# EAGLE design 00A-80 (EAGLE 6.3)
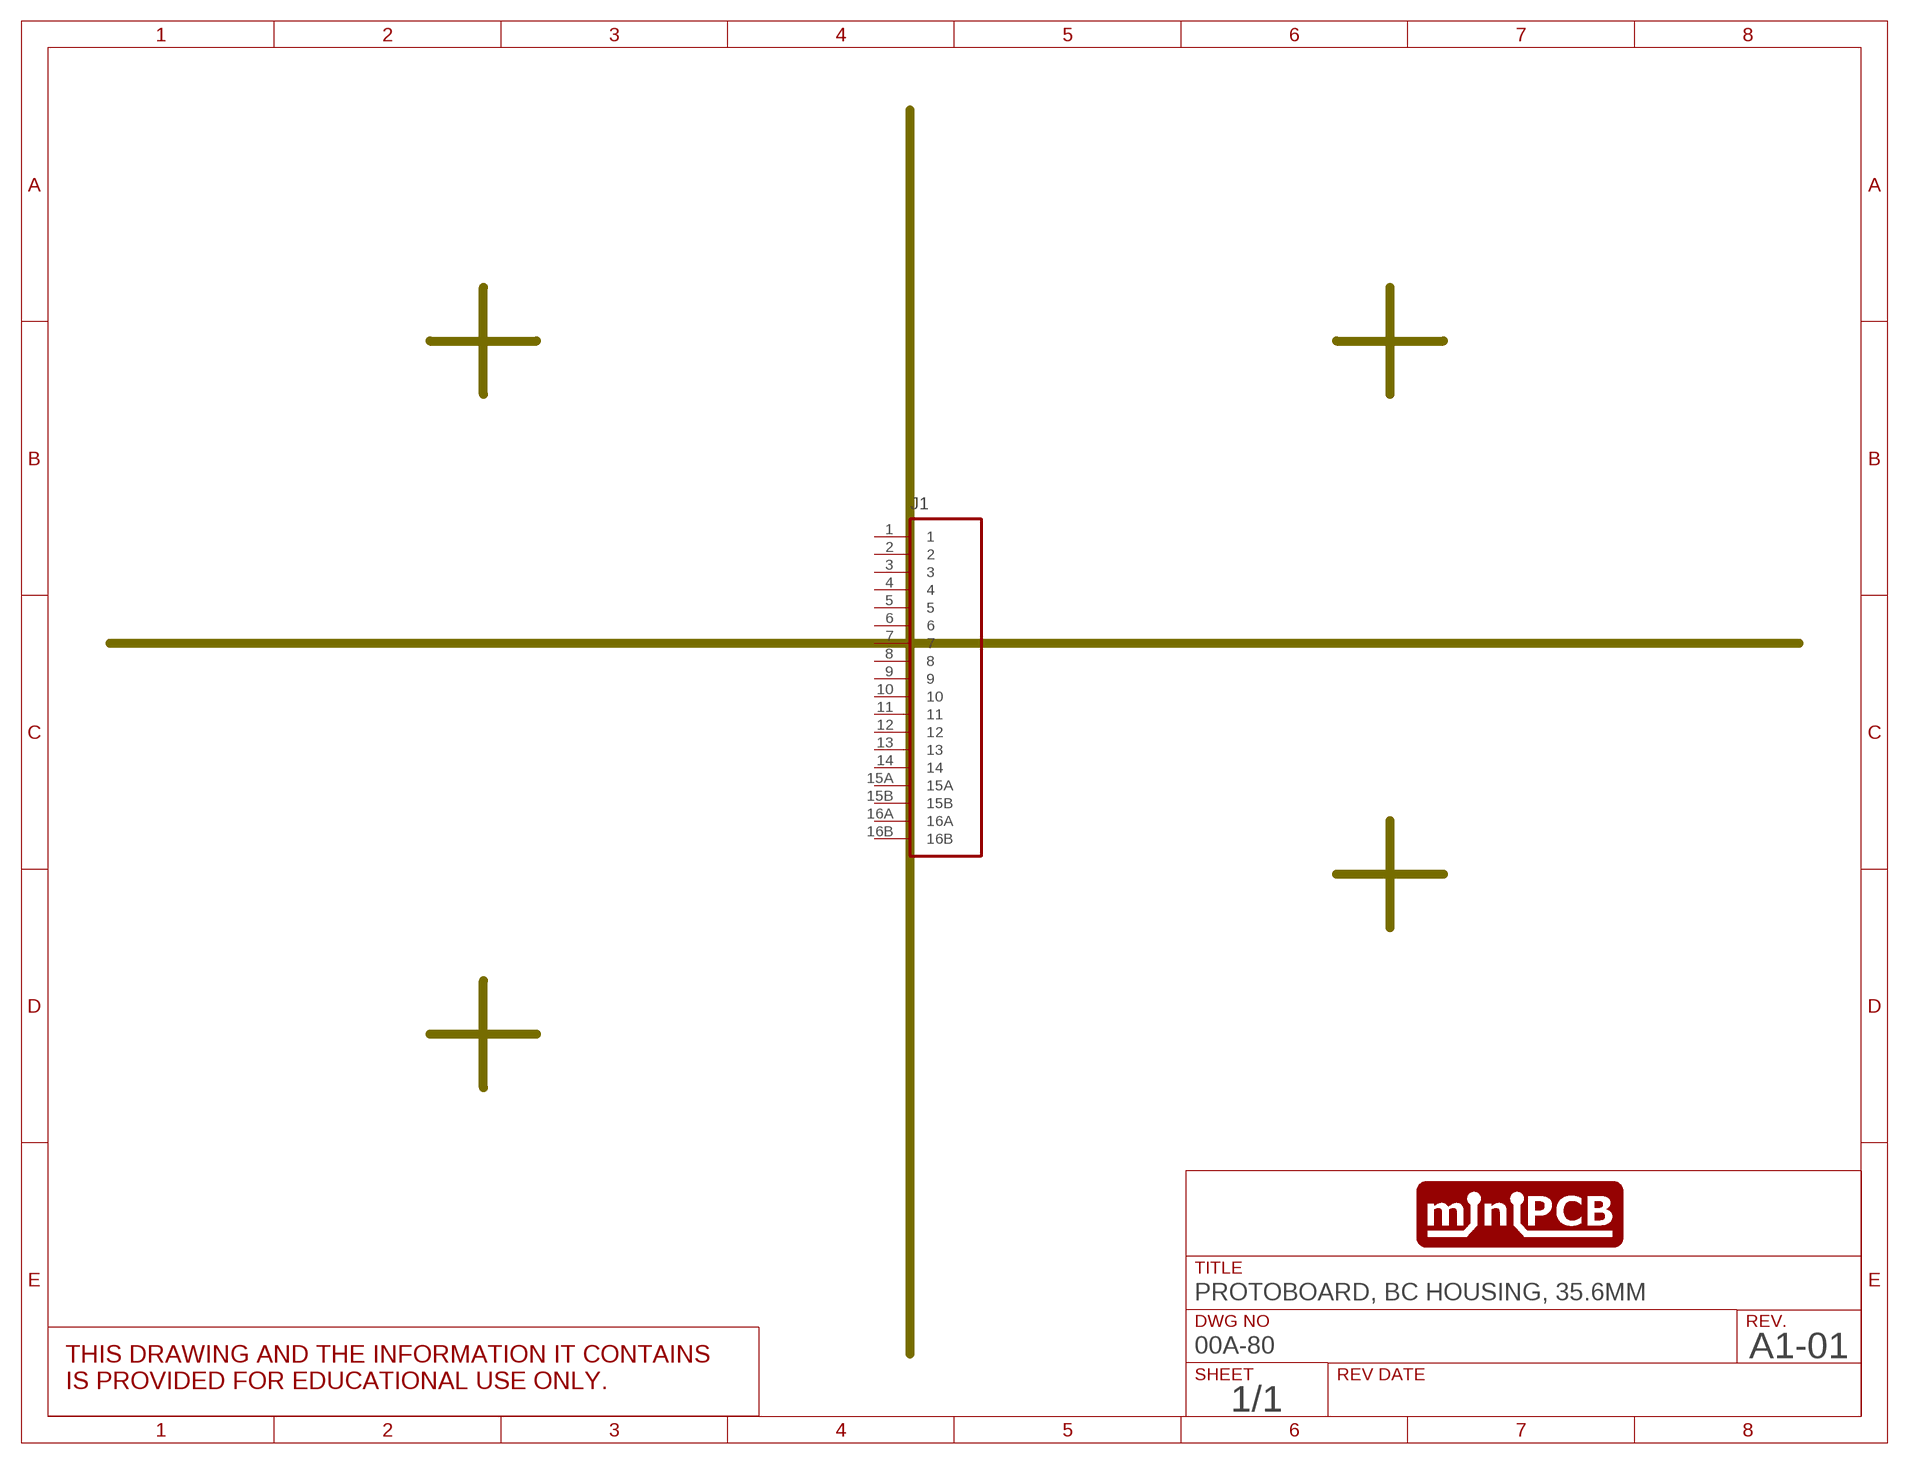
[diagram p0: schematic, sheet 1]
SHEET1 (SCHEMATIC): DWG_NO: 00A-80; REV: A1-01; TITLE: PROTOBOARD, BC HOUSING, 35.6MM

## Parts
J1  BC_HOUSING_35.6MM  [BC_HOUSING_35MM]
Unconnected: J1.1 J1.2 J1.3 J1.4 J1.5 J1.6 J1.7 J1.8 J1.9 J1.10 J1.11 J1.12 J1.13 J1.14 J1.15A J1.15B J1.16A J1.16B

## Library data of the parts
J1 = miniPCB_BOARDS:BC_HOUSING

## Board
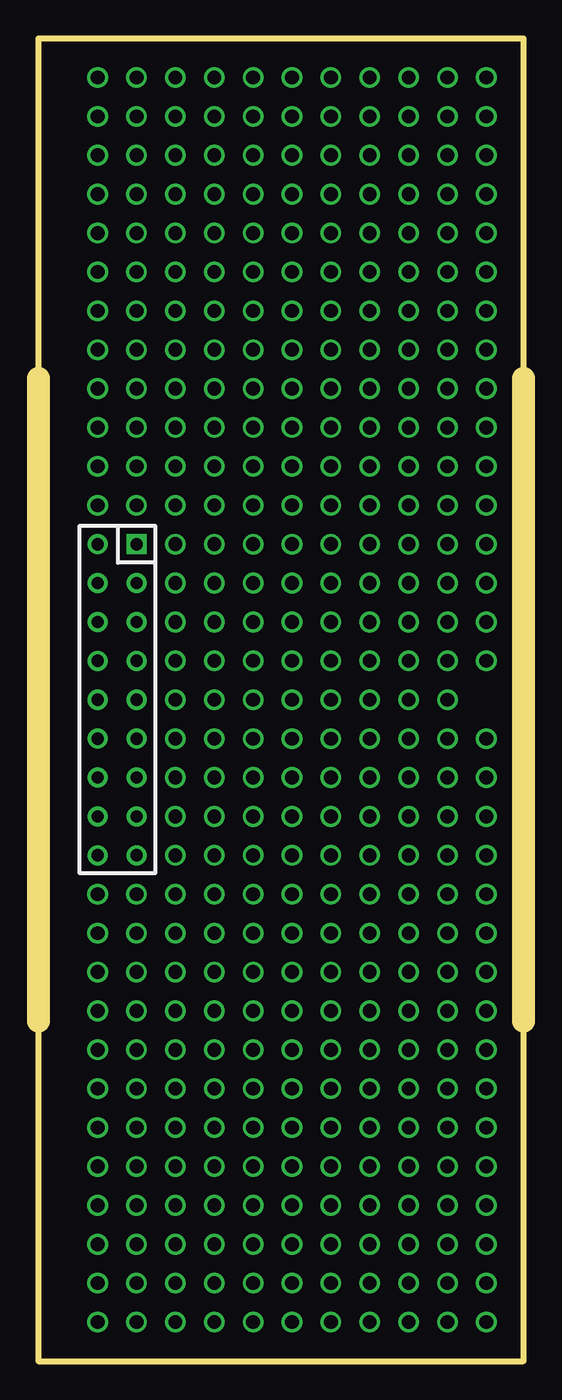
[diagram p1: board, top side]

Size 31.7 x 86.4 mm. Coordinates in mm from the lower left corner, seen from the top.
Copper layers (1*16): Top 0.035mm / dielectric 1.5mm / Bottom 0.035mm
Design rules "default": minimum track width 10mil, minimum drill 0.6mm, track to track 8mil, track to pad 8mil, pad to pad 8mil, via to via 8mil, smd to smd 8mil, copper to edge 40mil, drill to drill 8mil, minimum pad ring 10mil, minimum via ring 8mil, stop-mask expansion 4mil, vias tented up to drill 0mil, thermal gap 10mil

### Footprints (pad centres in the part's own frame; a part is rotated, then mirrored left to right if it is on the bottom)
BC_HOUSING_35MM = drill 0.8 square: 1 6.42,10.16 | drill 0.8: 2 3.88,10.16; 3 6.42,7.62; 4 3.88,7.62; 5 6.42,5.08; 6 3.88,5.08; 7 6.42,2.54; 8 3.88,2.54; 9 6.42,0; 10 3.88,0; 11 6.42,-2.54; 12 3.88,-2.54; 13 6.42,-5.08; 14 3.88,-5.08; 15A 6.42,-7.62; 15B 3.88,-7.62; 16A 6.42,-10.16; 16B 3.88,-10.16

### Placement (x,y rotation side)
J1  0,43.2 0 top

### Tracks (layer width: path | path; a pad name or v marks a point on that pad's centre or on a via)
N$1  (via drill 0.9)
  other vias: 3.88,60.98
N$2  (via drill 0.9)
  other vias: 3.88,58.44
N$3  (via drill 0.9)
  other vias: 6.42,58.44
N$4  (via drill 0.9)
  other vias: 6.42,60.98
N$5  (via drill 0.9)
  other vias: 8.96,60.98
N$6  (via drill 0.9)
  other vias: 8.96,58.44
N$7  (via drill 0.9)
  other vias: 3.88,55.9
N$8  (via drill 0.9)
  other vias: 6.42,55.9
N$9  (via drill 0.9)
  other vias: 8.96,55.9
N$10  (via drill 0.9)
  other vias: 8.96,53.36
N$11  (via drill 0.9)
  other vias: 8.96,50.82
N$12  (via drill 0.9)
  other vias: 8.96,48.28
N$13  (via drill 0.9)
  other vias: 8.96,45.74
N$14  (via drill 0.9)
  other vias: 8.96,43.2
N$15  (via drill 0.9)
  other vias: 8.96,40.66
N$16  (via drill 0.9)
  other vias: 8.96,38.12
N$17  (via drill 0.9)
  other vias: 8.96,35.58
N$18  (via drill 0.9)
  other vias: 8.96,33.04
N$19  (via drill 0.9)
  other vias: 8.96,30.5
N$20  (via drill 0.9)
  other vias: 6.42,30.5
N$21  (via drill 0.9)
  other vias: 3.88,30.5
N$22  (via drill 0.9)
  other vias: 3.88,27.96
N$23  (via drill 0.9)
  other vias: 6.42,27.96
N$24  (via drill 0.9)
  other vias: 8.96,27.96
N$25  (via drill 0.9)
  other vias: 3.88,25.42
N$26  (via drill 0.9)
  other vias: 6.42,25.42
N$27  (via drill 0.9)
  other vias: 8.96,25.42
N$28  (via drill 0.9)
  other vias: 8.96,22.88
N$29  (via drill 0.9)
  other vias: 6.42,22.88
N$30  (via drill 0.9)
  other vias: 3.88,22.88
N$31  (via drill 0.9)
  other vias: 11.5,22.88
N$32  (via drill 0.9)
  other vias: 11.5,25.42
N$33  (via drill 0.9)
  other vias: 11.5,27.96
N$34  (via drill 0.9)
  other vias: 11.5,30.5
N$35  (via drill 0.9)
  other vias: 11.5,33.04
N$36  (via drill 0.9)
  other vias: 11.5,35.58
N$37  (via drill 0.9)
  other vias: 11.5,38.12
N$38  (via drill 0.9)
  other vias: 11.5,40.66
N$39  (via drill 0.9)
  other vias: 11.5,43.2
N$40  (via drill 0.9)
  other vias: 11.5,45.74
N$41  (via drill 0.9)
  other vias: 11.5,48.28
N$42  (via drill 0.9)
  other vias: 11.5,50.82
N$43  (via drill 0.9)
  other vias: 11.5,53.36
N$44  (via drill 0.9)
  other vias: 11.5,55.9
N$45  (via drill 0.9)
  other vias: 11.5,58.44
N$46  (via drill 0.9)
  other vias: 11.5,60.98
N$47  (via drill 0.9)
  other vias: 11.5,63.52
N$48  (via drill 0.9)
  other vias: 8.96,63.52
N$49  (via drill 0.9)
  other vias: 6.42,63.52
N$50  (via drill 0.9)
  other vias: 3.88,63.52
N$51  (via drill 0.9)
  other vias: 14.04,60.98
N$52  (via drill 0.9)
  other vias: 14.04,58.44
N$53  (via drill 0.9)
  other vias: 14.04,55.9
N$54  (via drill 0.9)
  other vias: 14.04,53.36
N$55  (via drill 0.9)
  other vias: 14.04,50.82
N$56  (via drill 0.9)
  other vias: 14.04,48.28
N$57  (via drill 0.9)
  other vias: 14.04,45.74
N$58  (via drill 0.9)
  other vias: 14.04,43.2
N$59  (via drill 0.9)
  other vias: 14.04,40.66
N$60  (via drill 0.9)
  other vias: 14.04,38.12
N$61  (via drill 0.9)
  other vias: 14.04,35.58
N$62  (via drill 0.9)
  other vias: 14.04,33.04
N$63  (via drill 0.9)
  other vias: 14.04,30.5
N$64  (via drill 0.9)
  other vias: 14.04,27.96
N$65  (via drill 0.9)
  other vias: 14.04,25.42
N$66  (via drill 0.9)
  other vias: 14.04,22.88
N$67  (via drill 0.9)
  other vias: 16.58,22.88
N$68  (via drill 0.9)
  other vias: 16.58,25.42
N$69  (via drill 0.9)
  other vias: 16.58,27.96
N$70  (via drill 0.9)
  other vias: 16.58,30.5
N$71  (via drill 0.9)
  other vias: 16.58,33.04
N$72  (via drill 0.9)
  other vias: 16.58,35.58
N$73  (via drill 0.9)
  other vias: 16.58,38.12
N$74  (via drill 0.9)
  other vias: 16.58,40.66
N$75  (via drill 0.9)
  other vias: 16.58,43.2
N$76  (via drill 0.9)
  other vias: 16.58,45.74
N$77  (via drill 0.9)
  other vias: 16.58,48.28
N$78  (via drill 0.9)
  other vias: 16.58,50.82
N$79  (via drill 0.9)
  other vias: 16.58,53.36
N$80  (via drill 0.9)
  other vias: 16.58,55.9
N$81  (via drill 0.9)
  other vias: 16.58,58.44
N$82  (via drill 0.9)
  other vias: 16.58,60.98
N$83  (via drill 0.9)
  other vias: 16.58,63.52
N$84  (via drill 0.9)
  other vias: 14.04,63.52
N$85  (via drill 0.9)
  other vias: 19.12,60.98
N$86  (via drill 0.9)
  other vias: 19.12,58.44
N$87  (via drill 0.9)
  other vias: 19.12,55.9
N$88  (via drill 0.9)
  other vias: 19.12,53.36
N$89  (via drill 0.9)
  other vias: 19.12,50.82
N$90  (via drill 0.9)
  other vias: 19.12,48.28
N$91  (via drill 0.9)
  other vias: 19.12,45.74
N$92  (via drill 0.9)
  other vias: 19.12,43.2
N$93  (via drill 0.9)
  other vias: 19.12,40.66
N$94  (via drill 0.9)
  other vias: 19.12,38.12
N$95  (via drill 0.9)
  other vias: 19.12,35.58
N$96  (via drill 0.9)
  other vias: 19.12,33.04
N$97  (via drill 0.9)
  other vias: 19.12,30.5
N$98  (via drill 0.9)
  other vias: 19.12,27.96
N$99  (via drill 0.9)
  other vias: 19.12,25.42
N$100  (via drill 0.9)
  other vias: 19.12,22.88
N$101  (via drill 0.9)
  other vias: 21.66,22.88
N$102  (via drill 0.9)
  other vias: 21.66,25.42
N$103  (via drill 0.9)
  other vias: 21.66,27.96
N$104  (via drill 0.9)
  other vias: 21.66,30.5
N$105  (via drill 0.9)
  other vias: 21.66,33.04
N$106  (via drill 0.9)
  other vias: 21.66,35.58
N$107  (via drill 0.9)
  other vias: 21.66,38.12
N$108  (via drill 0.9)
  other vias: 21.66,40.66
N$109  (via drill 0.9)
  other vias: 21.66,43.2
N$110  (via drill 0.9)
  other vias: 21.66,45.74
N$111  (via drill 0.9)
  other vias: 21.66,48.28
N$112  (via drill 0.9)
  other vias: 21.66,50.82
N$113  (via drill 0.9)
  other vias: 21.66,53.36
N$114  (via drill 0.9)
  other vias: 21.66,55.9
N$115  (via drill 0.9)
  other vias: 21.66,58.44
N$116  (via drill 0.9)
  other vias: 21.66,60.98
N$117  (via drill 0.9)
  other vias: 21.66,63.52
N$118  (via drill 0.9)
  other vias: 19.12,63.52
N$119  (via drill 0.9)
  other vias: 24.2,60.98
N$120  (via drill 0.9)
  other vias: 24.2,58.44
N$121  (via drill 0.9)
  other vias: 24.2,55.9
N$122  (via drill 0.9)
  other vias: 24.2,53.36
N$123  (via drill 0.9)
  other vias: 24.2,50.82
N$124  (via drill 0.9)
  other vias: 24.2,48.28
N$125  (via drill 0.9)
  other vias: 24.2,45.74
N$126  (via drill 0.9)
  other vias: 24.2,43.2
N$127  (via drill 0.9)
  other vias: 24.2,40.66
N$128  (via drill 0.9)
  other vias: 24.2,38.12
N$129  (via drill 0.9)
  other vias: 24.2,35.58
N$130  (via drill 0.9)
  other vias: 24.2,33.04
N$131  (via drill 0.9)
  other vias: 24.2,30.5
N$132  (via drill 0.9)
  other vias: 24.2,27.96
N$133  (via drill 0.9)
  other vias: 24.2,25.42
N$134  (via drill 0.9)
  other vias: 24.2,22.88
N$135  (via drill 0.9)
  other vias: 26.74,22.88
N$136  (via drill 0.9)
  other vias: 26.74,25.42
N$137  (via drill 0.9)
  other vias: 26.74,27.96
N$138  (via drill 0.9)
  other vias: 26.74,30.5
N$139  (via drill 0.9)
  other vias: 26.74,33.04
N$140  (via drill 0.9)
  other vias: 26.74,35.58
N$141  (via drill 0.9)
  other vias: 26.74,38.12
N$142  (via drill 0.9)
  other vias: 26.74,40.66
N$143  (via drill 0.9)
  other vias: 26.74,43.2
N$144  (via drill 0.9)
  other vias: 26.74,45.74
N$145  (via drill 0.9)
  other vias: 26.74,48.28
N$146  (via drill 0.9)
  other vias: 26.74,50.82
N$147  (via drill 0.9)
  other vias: 26.74,53.36
N$148  (via drill 0.9)
  other vias: 26.74,55.9
N$149  (via drill 0.9)
  other vias: 26.74,58.44
N$150  (via drill 0.9)
  other vias: 26.74,60.98
N$151  (via drill 0.9)
  other vias: 26.74,63.52
N$152  (via drill 0.9)
  other vias: 24.2,63.52
N$153  (via drill 0.9)
  other vias: 29.28,22.88
N$154  (via drill 0.9)
  other vias: 29.28,25.42
N$155  (via drill 0.9)
  other vias: 29.28,27.96
N$156  (via drill 0.9)
  other vias: 29.28,30.5
N$157  (via drill 0.9)
  other vias: 29.28,33.04
N$158  (via drill 0.9)
  other vias: 29.28,35.58
N$159  (via drill 0.9)
  other vias: 29.28,38.12
N$160  (via drill 0.9)
  other vias: 29.28,40.66
N$161  (via drill 0.9)
  other vias: 3.88,71.14
N$162  (via drill 0.9)
  other vias: 29.28,45.74
N$163  (via drill 0.9)
  other vias: 29.28,48.28
N$164  (via drill 0.9)
  other vias: 29.28,50.82
N$165  (via drill 0.9)
  other vias: 29.28,53.36
N$166  (via drill 0.9)
  other vias: 29.28,55.9
N$167  (via drill 0.9)
  other vias: 29.28,58.44
N$168  (via drill 0.9)
  other vias: 29.28,60.98
N$169  (via drill 0.9)
  other vias: 29.28,63.52
N$170  (via drill 0.9)
  other vias: 3.88,68.6
N$171  (via drill 0.9)
  other vias: 6.42,68.6
N$172  (via drill 0.9)
  other vias: 6.42,71.14
N$173  (via drill 0.9)
  other vias: 8.96,71.14
N$174  (via drill 0.9)
  other vias: 8.96,68.6
N$175  (via drill 0.9)
  other vias: 3.88,66.06
N$176  (via drill 0.9)
  other vias: 6.42,66.06
N$177  (via drill 0.9)
  other vias: 8.96,66.06
N$178  (via drill 0.9)
  other vias: 11.5,66.06
N$179  (via drill 0.9)
  other vias: 11.5,68.6
N$180  (via drill 0.9)
  other vias: 11.5,71.14
N$181  (via drill 0.9)
  other vias: 11.5,73.68
N$182  (via drill 0.9)
  other vias: 8.96,73.68
N$183  (via drill 0.9)
  other vias: 6.42,73.68
N$184  (via drill 0.9)
  other vias: 3.88,73.68
N$185  (via drill 0.9)
  other vias: 14.04,71.14
N$186  (via drill 0.9)
  other vias: 14.04,68.6
N$187  (via drill 0.9)
  other vias: 14.04,66.06
N$188  (via drill 0.9)
  other vias: 16.58,66.06
N$189  (via drill 0.9)
  other vias: 16.58,68.6
N$190  (via drill 0.9)
  other vias: 16.58,71.14
N$191  (via drill 0.9)
  other vias: 16.58,73.68
N$192  (via drill 0.9)
  other vias: 14.04,73.68
N$193  (via drill 0.9)
  other vias: 19.12,71.14
N$194  (via drill 0.9)
  other vias: 19.12,68.6
N$195  (via drill 0.9)
  other vias: 19.12,66.06
N$196  (via drill 0.9)
  other vias: 21.66,66.06
N$197  (via drill 0.9)
  other vias: 21.66,68.6
N$198  (via drill 0.9)
  other vias: 21.66,71.14
N$199  (via drill 0.9)
  other vias: 21.66,73.68
N$200  (via drill 0.9)
  other vias: 19.12,73.68
N$201  (via drill 0.9)
  other vias: 24.2,71.14
N$202  (via drill 0.9)
  other vias: 24.2,68.6
N$203  (via drill 0.9)
  other vias: 24.2,66.06
N$204  (via drill 0.9)
  other vias: 26.74,66.06
N$205  (via drill 0.9)
  other vias: 26.74,68.6
N$206  (via drill 0.9)
  other vias: 26.74,71.14
N$207  (via drill 0.9)
  other vias: 26.74,73.68
N$208  (via drill 0.9)
  other vias: 24.2,73.68
N$209  (via drill 0.9)
  other vias: 29.28,66.06
N$210  (via drill 0.9)
  other vias: 29.28,68.6
N$211  (via drill 0.9)
  other vias: 29.28,71.14
N$212  (via drill 0.9)
  other vias: 29.28,73.68
N$213  (via drill 0.9)
  other vias: 3.88,17.8
N$214  (via drill 0.9)
  other vias: 3.88,15.26
N$215  (via drill 0.9)
  other vias: 6.42,15.26
N$216  (via drill 0.9)
  other vias: 6.42,17.8
N$217  (via drill 0.9)
  other vias: 8.96,17.8
N$218  (via drill 0.9)
  other vias: 8.96,15.26
N$219  (via drill 0.9)
  other vias: 3.88,12.72
N$220  (via drill 0.9)
  other vias: 6.42,12.72
N$221  (via drill 0.9)
  other vias: 8.96,12.72
N$222  (via drill 0.9)
  other vias: 11.5,12.72
N$223  (via drill 0.9)
  other vias: 11.5,15.26
N$224  (via drill 0.9)
  other vias: 11.5,17.8
N$225  (via drill 0.9)
  other vias: 11.5,20.34
N$226  (via drill 0.9)
  other vias: 8.96,20.34
N$227  (via drill 0.9)
  other vias: 6.42,20.34
N$228  (via drill 0.9)
  other vias: 3.88,20.34
N$229  (via drill 0.9)
  other vias: 14.04,17.8
N$230  (via drill 0.9)
  other vias: 14.04,15.26
N$231  (via drill 0.9)
  other vias: 14.04,12.72
N$232  (via drill 0.9)
  other vias: 16.58,12.72
N$233  (via drill 0.9)
  other vias: 16.58,15.26
N$234  (via drill 0.9)
  other vias: 16.58,17.8
N$235  (via drill 0.9)
  other vias: 16.58,20.34
N$236  (via drill 0.9)
  other vias: 14.04,20.34
N$237  (via drill 0.9)
  other vias: 19.12,17.8
N$238  (via drill 0.9)
  other vias: 19.12,15.26
N$239  (via drill 0.9)
  other vias: 19.12,12.72
N$240  (via drill 0.9)
  other vias: 21.66,12.72
N$241  (via drill 0.9)
  other vias: 21.66,15.26
N$242  (via drill 0.9)
  other vias: 21.66,17.8
N$243  (via drill 0.9)
  other vias: 21.66,20.34
N$244  (via drill 0.9)
  other vias: 19.12,20.34
N$245  (via drill 0.9)
  other vias: 24.2,17.8
N$246  (via drill 0.9)
  other vias: 24.2,15.26
N$247  (via drill 0.9)
  other vias: 24.2,12.72
N$248  (via drill 0.9)
  other vias: 26.74,12.72
N$249  (via drill 0.9)
  other vias: 26.74,15.26
N$250  (via drill 0.9)
  other vias: 26.74,17.8
N$251  (via drill 0.9)
  other vias: 26.74,20.34
N$252  (via drill 0.9)
  other vias: 24.2,20.34
N$253  (via drill 0.9)
  other vias: 29.28,12.72
N$254  (via drill 0.9)
  other vias: 29.28,15.26
N$255  (via drill 0.9)
  other vias: 29.28,17.8
N$256  (via drill 0.9)
  other vias: 29.28,20.34
N$257  (via drill 0.9)
  other vias: 3.88,7.64
N$258  (via drill 0.9)
  other vias: 3.88,5.1
N$259  (via drill 0.9)
  other vias: 6.42,5.1
N$260  (via drill 0.9)
  other vias: 6.42,7.64
N$261  (via drill 0.9)
  other vias: 8.96,7.64
N$262  (via drill 0.9)
  other vias: 8.96,5.1
N$263  (via drill 0.9)
  other vias: 3.88,2.56
N$264  (via drill 0.9)
  other vias: 6.42,2.56
N$265  (via drill 0.9)
  other vias: 8.96,2.56
N$266  (via drill 0.9)
  other vias: 11.5,2.56
N$267  (via drill 0.9)
  other vias: 11.5,5.1
N$268  (via drill 0.9)
  other vias: 11.5,7.64
N$269  (via drill 0.9)
  other vias: 11.5,10.18
N$270  (via drill 0.9)
  other vias: 8.96,10.18
N$271  (via drill 0.9)
  other vias: 6.42,10.18
N$272  (via drill 0.9)
  other vias: 3.88,10.18
N$273  (via drill 0.9)
  other vias: 14.04,7.64
N$274  (via drill 0.9)
  other vias: 14.04,5.1
N$275  (via drill 0.9)
  other vias: 14.04,2.56
N$276  (via drill 0.9)
  other vias: 16.58,2.56
N$277  (via drill 0.9)
  other vias: 16.58,5.1
N$278  (via drill 0.9)
  other vias: 16.58,7.64
N$279  (via drill 0.9)
  other vias: 16.58,10.18
N$280  (via drill 0.9)
  other vias: 14.04,10.18
N$281  (via drill 0.9)
  other vias: 19.12,7.64
N$282  (via drill 0.9)
  other vias: 19.12,5.1
N$283  (via drill 0.9)
  other vias: 19.12,2.56
N$284  (via drill 0.9)
  other vias: 21.66,2.56
N$285  (via drill 0.9)
  other vias: 21.66,5.1
N$286  (via drill 0.9)
  other vias: 21.66,7.64
N$287  (via drill 0.9)
  other vias: 21.66,10.18
N$288  (via drill 0.9)
  other vias: 19.12,10.18
N$289  (via drill 0.9)
  other vias: 24.2,7.64
N$290  (via drill 0.9)
  other vias: 24.2,5.1
N$291  (via drill 0.9)
  other vias: 24.2,2.56
N$292  (via drill 0.9)
  other vias: 26.74,2.56
N$293  (via drill 0.9)
  other vias: 26.74,5.1
N$294  (via drill 0.9)
  other vias: 26.74,7.64
N$295  (via drill 0.9)
  other vias: 26.74,10.18
N$296  (via drill 0.9)
  other vias: 24.2,10.18
N$297  (via drill 0.9)
  other vias: 29.28,2.56
N$298  (via drill 0.9)
  other vias: 29.28,5.1
N$299  (via drill 0.9)
  other vias: 29.28,7.64
N$300  (via drill 0.9)
  other vias: 29.28,10.18
N$301  (via drill 0.9)
  other vias: 3.88,81.3
N$302  (via drill 0.9)
  other vias: 3.88,78.76
N$303  (via drill 0.9)
  other vias: 6.42,78.76
N$304  (via drill 0.9)
  other vias: 6.42,81.3
N$305  (via drill 0.9)
  other vias: 8.96,81.3
N$306  (via drill 0.9)
  other vias: 8.96,78.76
N$307  (via drill 0.9)
  other vias: 3.88,76.22
N$308  (via drill 0.9)
  other vias: 6.42,76.22
N$309  (via drill 0.9)
  other vias: 8.96,76.22
N$310  (via drill 0.9)
  other vias: 11.5,76.22
N$311  (via drill 0.9)
  other vias: 11.5,78.76
N$312  (via drill 0.9)
  other vias: 11.5,81.3
N$313  (via drill 0.9)
  other vias: 11.5,83.84
N$314  (via drill 0.9)
  other vias: 8.96,83.84
N$315  (via drill 0.9)
  other vias: 6.42,83.84
N$316  (via drill 0.9)
  other vias: 3.88,83.84
N$317  (via drill 0.9)
  other vias: 14.04,81.3
N$318  (via drill 0.9)
  other vias: 14.04,78.76
N$319  (via drill 0.9)
  other vias: 14.04,76.22
N$320  (via drill 0.9)
  other vias: 16.58,76.22
N$321  (via drill 0.9)
  other vias: 16.58,78.76
N$322  (via drill 0.9)
  other vias: 16.58,81.3
N$323  (via drill 0.9)
  other vias: 16.58,83.84
N$324  (via drill 0.9)
  other vias: 14.04,83.84
N$325  (via drill 0.9)
  other vias: 19.12,81.3
N$326  (via drill 0.9)
  other vias: 19.12,78.76
N$327  (via drill 0.9)
  other vias: 19.12,76.22
N$328  (via drill 0.9)
  other vias: 21.66,76.22
N$329  (via drill 0.9)
  other vias: 21.66,78.76
N$330  (via drill 0.9)
  other vias: 21.66,81.3
N$331  (via drill 0.9)
  other vias: 21.66,83.84
N$332  (via drill 0.9)
  other vias: 19.12,83.84
N$333  (via drill 0.9)
  other vias: 24.2,81.3
N$334  (via drill 0.9)
  other vias: 24.2,78.76
N$335  (via drill 0.9)
  other vias: 24.2,76.22
N$336  (via drill 0.9)
  other vias: 26.74,76.22
N$337  (via drill 0.9)
  other vias: 26.74,78.76
N$338  (via drill 0.9)
  other vias: 26.74,81.3
N$339  (via drill 0.9)
  other vias: 26.74,83.84
N$340  (via drill 0.9)
  other vias: 24.2,83.84
N$341  (via drill 0.9)
  other vias: 29.28,76.22
N$342  (via drill 0.9)
  other vias: 29.28,78.76
N$343  (via drill 0.9)
  other vias: 29.28,81.3
N$344  (via drill 0.9)
  other vias: 29.28,83.84